# Altium project 2409_MesureTH_RefrigerateurCongelateur_V1.PrjPcb
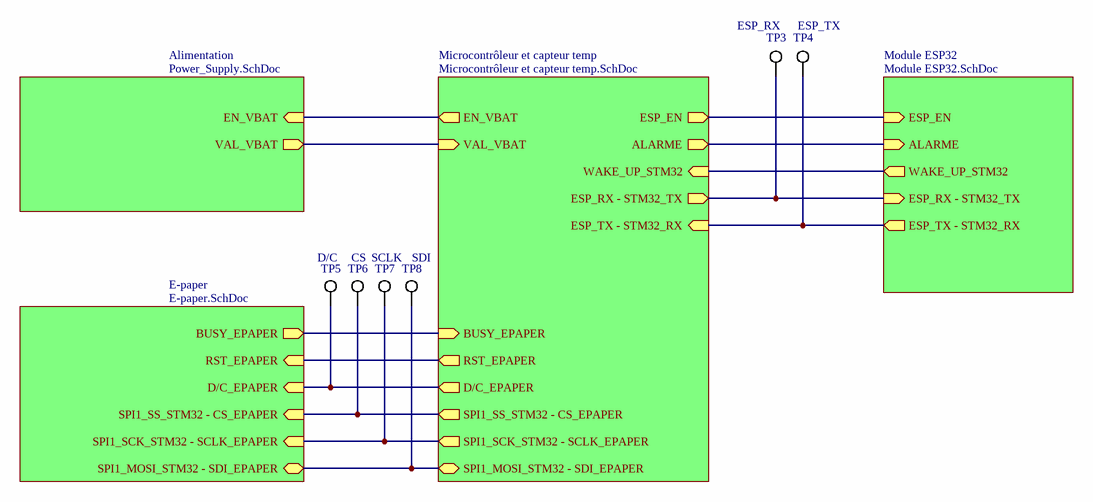
[diagram p0: Schéma bloc.SchDoc]
5 sheets, 80 parts. Net scope: hierarchical (ports join the sheet entries above them; power ports are global).
Board file: 2409_MesureTH_RefrigerateurCongelateur_6C_2L.PcbDoc
Sheets:
  Schéma bloc.SchDoc
    Alimentation = Power_Supply.SchDoc
    Microcontrôleur et capteur temp = Microcontrôleur et capteur temp.SchDoc
    E-paper = E-paper.SchDoc
    Module ESP32 = Module ESP32.SchDoc

## Sheet Schéma bloc.SchDoc: MesureTH
size 276 x 198 mm; Date: 21.08.2024; CheckedBy: CFO; DrawnBy: MPT; Organization: ETML-ES; Address1: Av. Recordon 1bis; Address2: 1004 Lausanne; Address3: Suisse; DocumentNumber: 2409; SheetNumber: 1; SheetTotal: 5; CheckingDate: 26.08.2024

### Parts
TP3  Test_Point_SMD  [5019]  (value not drawn)
TP4  Test_Point_SMD  [5019]  (value not drawn)
TP5  Test_Point_SMD  [5019]  (value not drawn)
TP6  Test_Point_SMD  [5019]  (value not drawn)
TP7  Test_Point_SMD  [5019]  (value not drawn)
TP8  Test_Point_SMD  [5019]  (value not drawn)

### Sub-sheets
Alimentation = Power_Supply.SchDoc: EN_VBAT (in), VAL_VBAT (out)
E-paper = E-paper.SchDoc: BUSY_EPAPER (out), SPI1_MOSI_STM32 - SDI_EPAPER (bidir), RST_EPAPER (in), D/C_EPAPER (in), SPI1_SS_STM32 - CS_EPAPER (in), SPI1_SCK_STM32 - SCLK_EPAPER (in)
Microcontrôleur et capteur temp = Microcontrôleur et capteur temp.SchDoc: EN_VBAT (out), VAL_VBAT (in), BUSY_EPAPER (in), RST_EPAPER (out), D/C_EPAPER (out), SPI1_SS_STM32 - CS_EPAPER (out), SPI1_SCK_STM32 - SCLK_EPAPER (out), SPI1_MOSI_STM32 - SDI_EPAPER (bidir), ESP_EN (out), ALARME (out), WAKE_UP_STM32 (in), ESP_RX - STM32_TX (out), ESP_TX - STM32_RX (in)
Module ESP32 = Module ESP32.SchDoc: ESP_EN (in), ALARME (in), WAKE_UP_STM32 (out), ESP_RX - STM32_TX (in), ESP_TX - STM32_RX (out)

### Nets
IO4: sheet Microcontrôleur et capteur temp/ALARME, sheet Module ESP32/ALARME
IO5: sheet Microcontrôleur et capteur temp/WAKE_UP_STM32, sheet Module ESP32/WAKE_UP_STM32
NetC5_1: sheet Alimentation/VAL_VBAT, sheet Microcontrôleur et capteur temp/VAL_VBAT
NetC16_1: sheet Microcontrôleur et capteur temp/ESP_EN, sheet Module ESP32/ESP_EN
NetJ6_9: sheet Microcontrôleur et capteur temp/BUSY_EPAPER, sheet E-paper/BUSY_EPAPER
NetJ6_10: sheet Microcontrôleur et capteur temp/RST_EPAPER, sheet E-paper/RST_EPAPER
NetJ6_11: TP5.1 ; sheet Microcontrôleur et capteur temp/D/C_EPAPER, sheet E-paper/D/C_EPAPER
NetJ6_12: TP6.1 ; sheet Microcontrôleur et capteur temp/SPI1_SS_STM32 - CS_EPAPER, sheet E-paper/SPI1_SS_STM32 - CS_EPAPER
NetJ6_13: TP7.1 ; sheet Microcontrôleur et capteur temp/SPI1_SCK_STM32 - SCLK_EPAPER, sheet E-paper/SPI1_SCK_STM32 - SCLK_EPAPER
NetJ6_14: TP8.1 ; sheet Microcontrôleur et capteur temp/SPI1_MOSI_STM32 - SDI_EPAPER, sheet E-paper/SPI1_MOSI_STM32 - SDI_EPAPER
NetQ2_1: sheet Alimentation/EN_VBAT, sheet Microcontrôleur et capteur temp/EN_VBAT
NetTP3_1: TP3.1 ; sheet Microcontrôleur et capteur temp/ESP_RX - STM32_TX, sheet Module ESP32/ESP_RX - STM32_TX
NetTP4_1: TP4.1 ; sheet Microcontrôleur et capteur temp/ESP_TX - STM32_RX, sheet Module ESP32/ESP_TX - STM32_RX

### Notes on the sheet
- ESP_RX
- ESP_TX
- D/C
- CS
- SCLK
- SDI
- a
- Dessiné
- A4
- Echelle :
- Mod.
- b
- c
- d
- Contrôlé
- Remplace
- Nb. feuilles
- Feuille n°
- Nom du projet
- No

## Sheet Power_Supply.SchDoc: MesureTH
size 276 x 198 mm; Date: 21.08.2024; CheckedBy: CFO; DrawnBy: MPT; Organization: ETML-ES; Address1: Av. Recordon 1bis; Address2: 1004 Lausanne; Address3: Suisse; DocumentNumber: 2409; SheetNumber: 2; SheetTotal: 5; CheckingDate: 26.08.2024
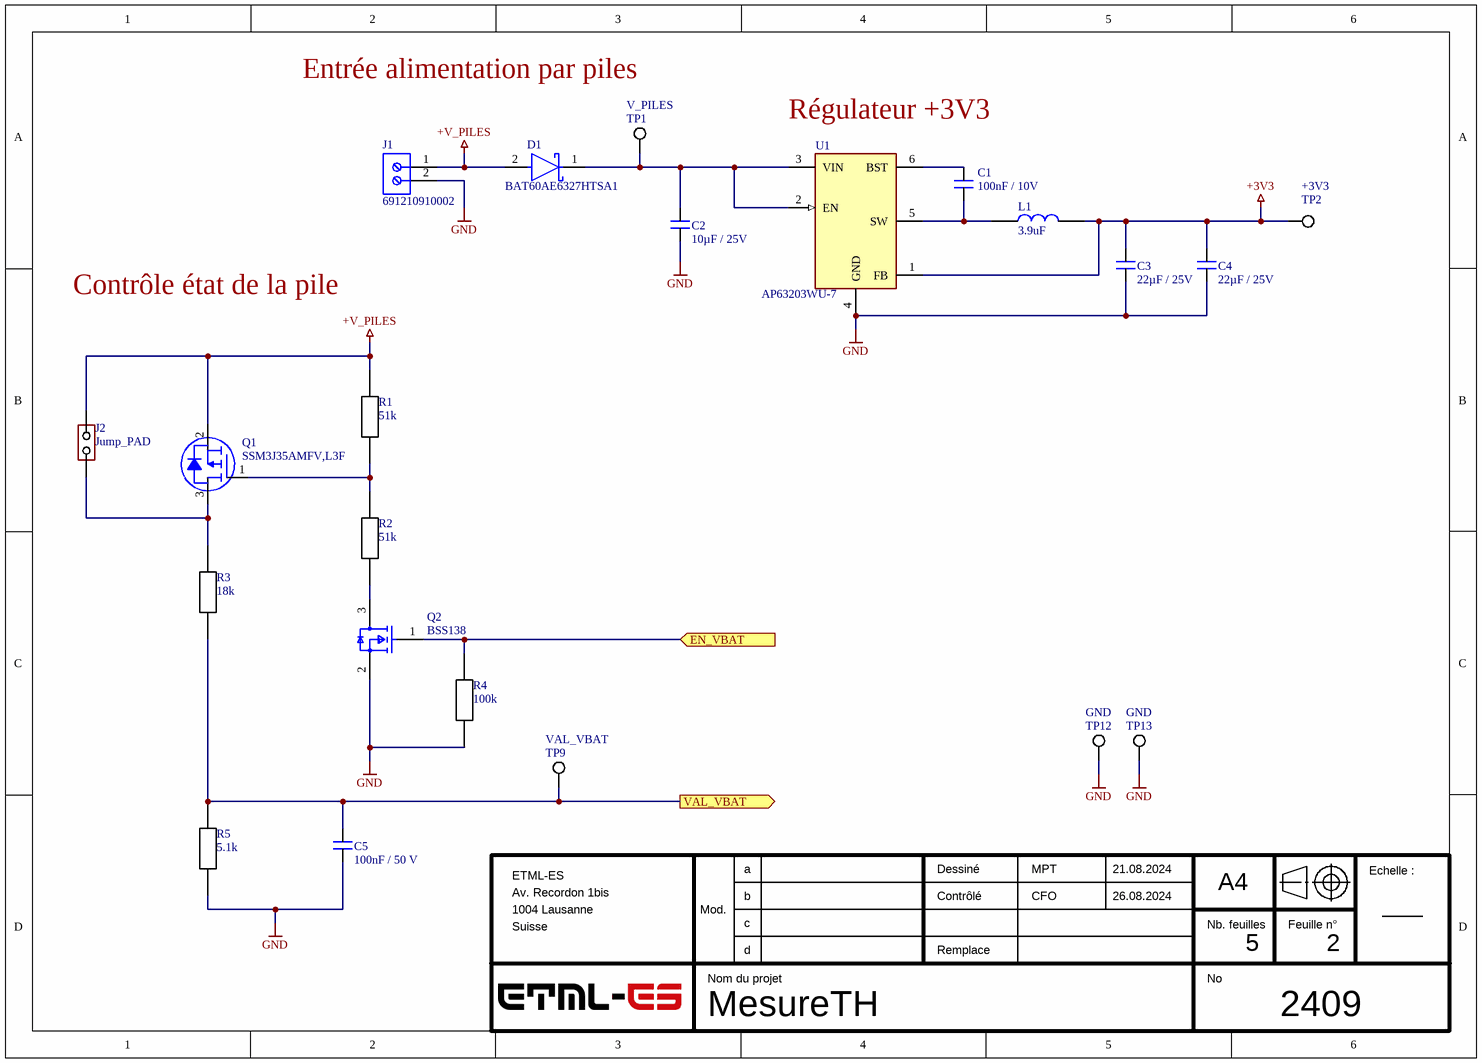
[diagram p1: Power_Supply.SchDoc]

### Parts
C1  100nF / 10V  [WCAP-CSGP_0805_L2W1.25H0.8_Wave]
C2  10µF / 25V  [WCAP-CSGP_0805_L2W1.25H0.8_Wave]
C3  22µF / 25V  [WCAP-CSGP_0805_L2W1.25H0.8_Wave]
C4  22µF / 25V  [WCAP-CSGP_0805_L2W1.25H0.8_Wave]
C5  100nF / 50 V  [WCAP-CSGP_0805_L2W1.25H0.8_Wave]
D1  BAT60AE6327HTSA1  [FP-PG-SOD323-2-IPC_C]
J1  691210910002  [691210910002]
J2  Jump_PAD  [Jump_PAD]
L1  3.9uF  [Inductance 3.9uF]
Q1  SSM3J35AMFV,L3F  [SSM3J35AMFV]
Q2  BSS138  [FP-318-08-IPC_B]
R1  51k  [WRIS-PSMB_0805_L2W1.25H0.35]
R2  51k  [WRIS-PSMB_0805_L2W1.25H0.35]
R3  18k  [WRIS-PSMB_0805_L2W1.25H0.35]
R4  100k  [WRIS-PSMB_0805_L2W1.25H0.35]
R5  5.1k  [WRIS-PSMB_0805_L2W1.25H0.35]
TP1  Test_Point_SMD  [5019]  (value not drawn)
TP2  Test_Point_SMD  [5019]  (value not drawn)
TP9  Test_Point_SMD  [5019]  (value not drawn)
TP12  Test_Point_SMD  [5019]  (value not drawn)
TP13  Test_Point_SMD  [5019]  (value not drawn)
U1  AP63203WU-7  [FP-TSOT26-MFG - duplicate]

### Ports
EN_VBAT (in), VAL_VBAT (out)

### Nets
+3V3: C3.1(+) C4.1(+) L1.2 TP2.1 U1.1(FB)
+V_PILES: D1.2(A) J1.1 J2.2 Q1.2(S) R1.2
GND: C2.2(-) C3.2(-) C4.2(-) C5.2(-) J1.2 Q2.2(S) R4.1 R5.1 TP12.1 TP13.1 U1.4(GND)
NetC1_1: C1.1(+) U1.6(BST)
NetC1_2: C1.2(-) L1.1 U1.5(SW)
NetC2_1: C2.1(+) D1.1(C) TP1.1 U1.2(EN) U1.3(VIN)
NetC5_1: C5.1(+) R3.1 R5.2 TP9.1 ; port VAL_VBAT
NetJ2_1: J2.1 Q1.3(D) R3.2
NetQ1_1: Q1.1(G) R1.1 R2.2
NetQ2_1: Q2.1(G) R4.2 ; port EN_VBAT
NetQ2_3: Q2.3(D) R2.1

### Notes on the sheet
- Entrée alimentation par piles
- (near TP1) V_PILES
- Régulateur +3V3
- (near TP2) +3V3
- Contrôle état de la pile
- (near TP9) VAL_VBAT
- (near TP12) GND
- GND
- a
- Dessiné
- A4
- Echelle :
- Mod.
- b
- c
- d
- Contrôlé
- Remplace
- Nb. feuilles
- Feuille n°
- Nom du projet
- No

### Library data of the parts
C1-C5 = CAPA: Tension: *
D1 = CMP-32890-000004-1: DIODE SCHOTTKY 10V 3A SOD323-2; Forward Voltage: 370mV; Polarity: Standard; Peak Non-Repetitive Surge Current: 5A; Element Configuration: Single; Max Operating Temperature: 85°C; Current Rating: 3A; Number of Pins: 2; Mount: Surface Mount; Forward Current: 3A; Max Reverse Voltage (DC): 10V; Output Current: 3A; Contact Plating: Tin; Average Rectified Current: 3A; Lead Free: Lead Free; Max Repetitive Reverse Voltage (Vrrm): 10V; Voltage Rating (DC): 10V; Radiation Hardening: No; Halogen Free: Not Halogen Free; Case/Package: SOD-323-2; REACH SVHC: No SVHC; Min Operating Temperature: -55°C; Packaging: Tape and Reel
J1 = CMP-1502-02456-2: NexarPartId: 105950649; Current Rating: 6A; Voltage Rating: 150V; Number of Contacts: 2; Number of Rows: 1; Contact Material: Tin; Height: 8.7mm; Max Operating Temperature: 105°C; Min Operating Temperature: -40°C
J2 = Jump_PAD: jump pad smd
L1 = Inductance 3.9uF: FIXED IND 3.9UH 850MA 200 MOHM; MF: EPCOS; MP: B82432T1392K000; SnapEDA_Link: https://www.snapeda.com/parts/B82432T1392K000/EPCOS/view-part/?ref=snap; Package: 1812 EPCOS (TDK); Value: *; Check_prices: https://www.snapeda.com/parts/B82432T1392K000/EPCOS/view-part/?ref=eda; Supplier 1: Digi-Key
Q1 = SSM3J35AMFV,L3F: Canal P 20 V 250mA (Ta) 150mW (Ta) Montage en surface VESM
Q2 = CMP-07173-000101-1: MOSFET N-CH 50V 220MA SOT-23; Turn-Off Delay Time: 20ns; Element Configuration: Single; Rds On Max: 3.5R; Gate to Source Voltage (Vgs): 20V; Threshold Voltage: 1.3V; Number of Elements: 1; Power Dissipation: 360mW; Rise Time: 9ns; Turn-On Delay Time: 2.5ns; Input Capacitance: 27pF; On-State Resistance: 6R; Lead Free: Lead Free; Length: 2.92mm; Width: 1.3mm; Drain to Source Breakdown Voltage: 50V; Min Operating Temperature: -55°C; REACH SVHC: No SVHC; Packaging: Tape and Reel; Radiation Hardening: No; Height: 0.93mm; Drain to Source Voltage (Vdss): 50V; Current Rating: 220mA; Voltage Rating (DC): 50V; Weight: 0.03g; Continuous Drain Current (ID): 220mA; Number of Pins: 3; Nominal Vgs: 1.3V; Max Power Dissipation: 360mW; Fall Time: 9ns; Drain to Source Resistance: 3.5R; Contact Plating: Tin; Case/Package: SOT-23; Package Quantity: 1; Dual Supply Voltage: 50V; Mount: Surface Mount; Termination: SMD/SMT; Max Operating Temperature: 150°C
R1-R5 = Resistance
U1 = Regulateur 3.3V: IC REG BUCK 3.3V 2A TSOT26; Manufacturer: Diodes Inc.; Output Type: Fixed; Min Supply Voltage: 3.8V; Number Of Outputs: 1; Max Junction Temp: +160°C; Nominal Supply Current: 22uA; Standoff Height: 0.01mm; Switching Frequency: 1.1MHz; Max Supply Voltage: 32V; ComponentLink2Description: Datasheet; Device Class L1: Integrated Circuits (ICs); Temperature: to +160°C; Device Class L3: Voltage Regulators - Switching; RoHS: TRUE; Octopart: https://octopart.com/ap63203wu-7-diodes+inc.-98099550; Output Voltage: 3.3V; Lead Free: Yes; ComponentLink2URL: https://www.diodes.com/assets/Datasheets/AP63200-AP63201-AP63203-AP63205.pdf; Digikey Description: IC REG BUCK 3.3V 2A TSOT26; Footprint Url: https://www.diodes.com/assets/Package-Files/TSOT26.pdf; Ambient Temperature Range High: +85°C; Height: 1mm; Automotive: No; Temperature Range High: +160°C; Switching Topology: Buck; Output Current: 2A; Package: TSOT26; Category: IC; Mouser Description: AP63203 Series 3.3 V 2 A SMT Fixed Low IQ Synchronous Buck - TSOT-26; Device Class L2: Power Management ICs; Ambient Temperature Range Low: -40°C; Manufacturer Part Number: AP63203WU-7

## Sheet Microcontrôleur et capteur temp.SchDoc: MesureTH
size 276 x 198 mm; Date: 21.08.2024; CheckedBy: CFO; DrawnBy: MPT; Organization: ETML-ES; Address1: Av. Recordon 1bis; Address2: 1004 Lausanne; Address3: Suisse; DocumentNumber: 2409; SheetNumber: 3; SheetTotal: 5; CheckingDate: 26.08.2024
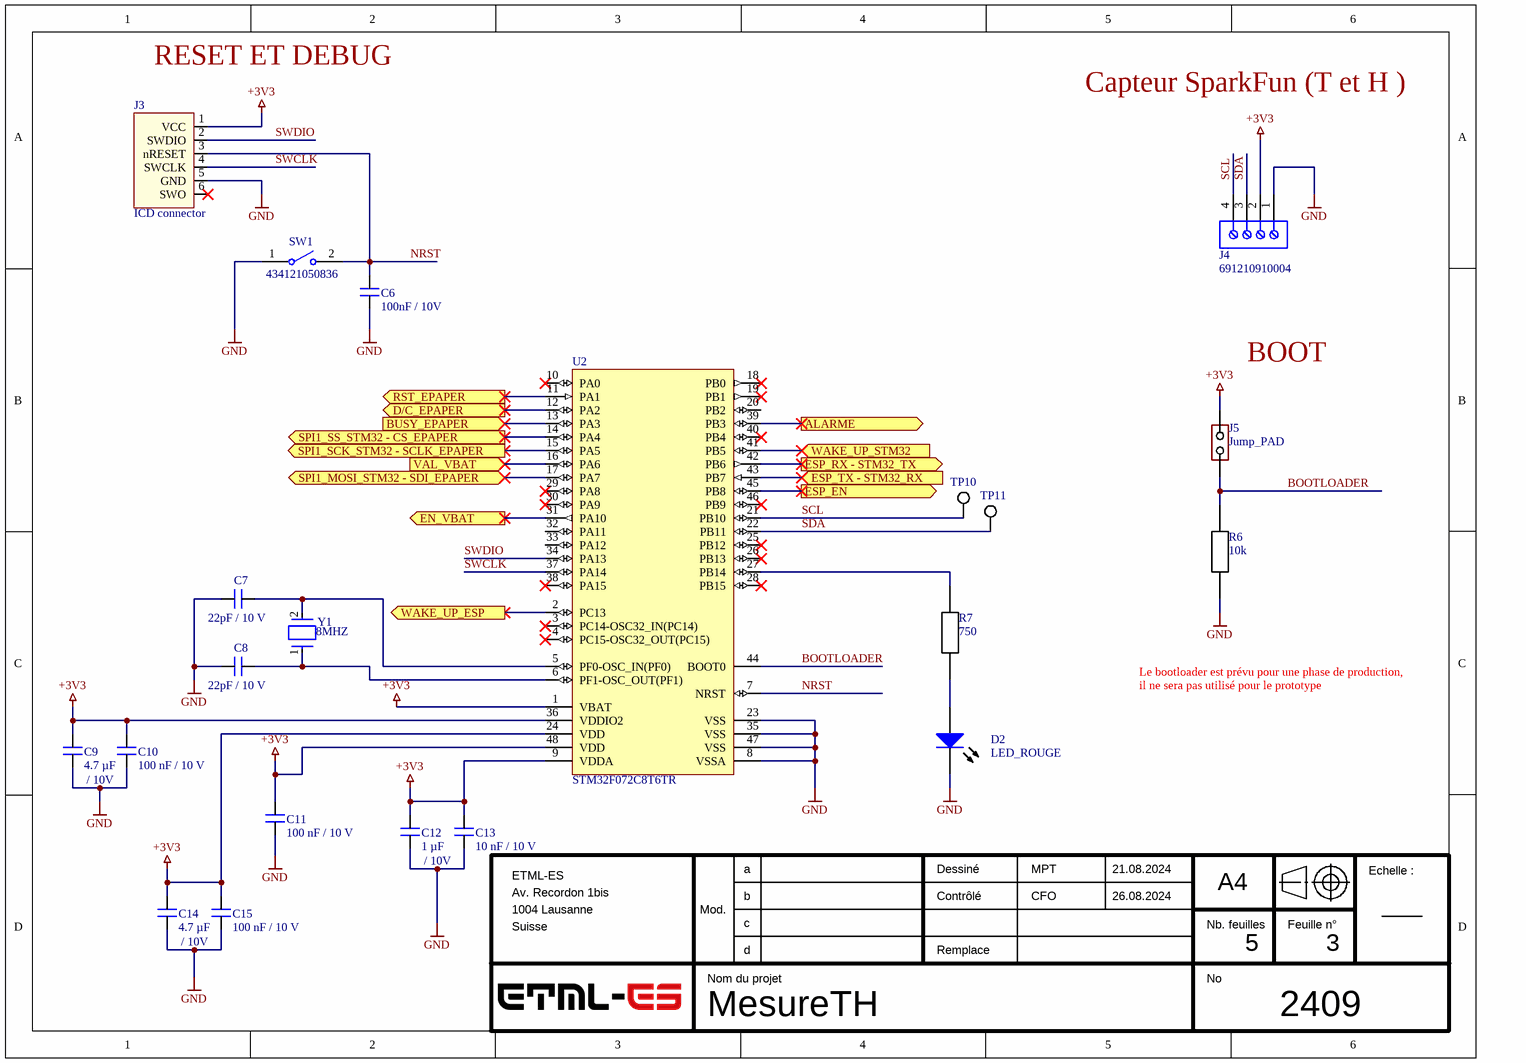
[diagram p2: Microcontrôleur et capteur temp.SchDoc]

### Parts
C6  100nF / 10V  [WCAP-CSGP_0805_L2W1.25H0.8_Wave]
C7  22pF / 10 V  [WCAP-CSGP_0805_L2W1.25H0.8_Wave]
C8  22pF / 10 V  [WCAP-CSGP_0805_L2W1.25H0.8_Wave]
C9  4.7 µF  [WCAP-CSGP_0805_L2W1.25H0.8_Wave]
C10  100 nF / 10 V  [WCAP-CSGP_0805_L2W1.25H0.8_Wave]
C11  100 nF / 10 V  [WCAP-CSGP_0805_L2W1.25H0.8_Wave]
C12  1 µF  [WCAP-CSGP_0805_L2W1.25H0.8_Wave]
C13  10 nF / 10 V  [WCAP-CSGP_0805_L2W1.25H0.8_Wave]
C14  4.7 µF  [WCAP-CSGP_0805_L2W1.25H0.8_Wave]
C15  100 nF / 10 V  [WCAP-CSGP_0805_L2W1.25H0.8_Wave]
D2  LED_ROUGE  [LED_SMD_B_AND_R]
J3  ICD connector  [TC2030-MCP]  (no BOM)
J4  691210910004  [691210910004]
J5  Jump_PAD  [Jump_PAD]
R6  10k  [WRIS-PSMB_0805_L2W1.25H0.35]
R7  750  [WRIS-PSMB_0805_L2W1.25H0.35]
SW1  434121050836  [WS-TASV_L6W3.5H5_4341x10508x6]
TP10  Test_Point_SMD  [5019]  (value not drawn)
TP11  Test_Point_SMD  [5019]  (value not drawn)
U2  STM32F072C8T6TR  [LQFP48-7x7mm]
Y1  8MHZ  [FP-ABLS-MFG]

### Ports
ALARME (out), BUSY_EPAPER (in), D/C_EPAPER (out), EN_VBAT (out), ESP_EN (out), ESP_RX - STM32_TX (out), ESP_TX - STM32_RX (in), RST_EPAPER (out), SPI1_MOSI_STM32 - SDI_EPAPER (bidir), SPI1_SCK_STM32 - SCLK_EPAPER (out), SPI1_SS_STM32 - CS_EPAPER (out), VAL_VBAT (in), WAKE_UP_ESP (out), WAKE_UP_STM32 (in)

### Nets
+3V3: C9.1(+) C10.1(+) C11.1(+) C12.1(+) C13.1(+) C14.1(+) C15.1(+) J3.1(VCC) J4.2 J5.2 U2.1(VBAT) U2.9(VDDA) U2.24(VDD) U2.36(VDDIO2) U2.48(VDD)
GND: C6.2(-) C7.1(+) C8.1(+) C9.2(-) C10.2(-) C11.2(-) C12.2(-) C13.2(-) C14.2(-) C15.2(-) D2.1(K) J3.5(GND) J4.1 R6.1 SW1.1 U2.8(VSSA) U2.23(VSS) U2.35(VSS) U2.47(VSS)
BOOTLOADER: J5.1 R6.2 U2.44(BOOT0)
IO4: U2.39(PB3) ; port ALARME
IO5: U2.41(PB5) ; port WAKE_UP_STM32
NRST: C6.1(+) J3.3(nRESET) SW1.2 U2.7(NRST)
SCL: J4.4 TP10.1 U2.21(PB10)
SDA: J4.3 TP11.1 U2.22(PB11)
SWCLK: J3.4(SWCLK) U2.37(PA14)
SWDIO: J3.2(SWDIO) U2.34(PA13)
NetC5_1: U2.16(PA6) ; port VAL_VBAT
NetC7_2: C7.2(-) U2.5(PF0-OSC_IN(PF0)) Y1.2
NetC8_2: C8.2(-) U2.6(PF1-OSC_OUT(PF1)) Y1.1
NetC16_1: U2.45(PB8) ; port ESP_EN
NetD2_2: D2.2(A) R7.1
NetJ6_9: U2.13(PA3) ; port BUSY_EPAPER
NetJ6_10: U2.11(PA1) ; port RST_EPAPER
NetJ6_11: U2.12(PA2) ; port D/C_EPAPER
NetJ6_12: U2.14(PA4) ; port SPI1_SS_STM32 - CS_EPAPER
NetJ6_13: U2.15(PA5) ; port SPI1_SCK_STM32 - SCLK_EPAPER
NetJ6_14: U2.17(PA7) ; port SPI1_MOSI_STM32 - SDI_EPAPER
NetQ2_1: U2.31(PA10) ; port EN_VBAT
NetR7_2: R7.2 U2.27(PB14)
NetTP3_1: U2.42(PB6) ; port ESP_RX - STM32_TX
NetTP4_1: U2.43(PB7) ; port ESP_TX - STM32_RX
NetU2_2: U2.2(PC13) ; port WAKE_UP_ESP

Not connected (* = marked no-connect by the designer): J3 6(SWO)*; U2 3(PC14-OSC32_IN(PC14))* 4(PC15-OSC32_OUT(PC15))* 10(PA0)* 18(PB0)* 19(PB1)* 20(PB2) 25(PB12)* 26(PB13)* 28(PB15)* 29(PA8)* 30(PA9)* 32(PA11) 33(PA12) 38(PA15)* 40(PB4)* 46(PB9)*

### Notes on the sheet
- RESET ET DEBUG
- Capteur SparkFun (T et H )
- BOOT
- Le bootloader est prévu pour une phase de production,
- il ne sera pas utilisé pour le prototype
- / 10V
- a
- Dessiné
- A4
- Echelle :
- Mod.
- b
- c
- d
- Contrôlé
- Remplace
- Nb. feuilles
- Feuille n°
- Nom du projet
- No

### Library data of the parts
C6-C15 = CAPA: Tension: *
D2 = LED
J3 = TC2030-MCP-NL: Conector par STlinj
J4 = CMP-1502-02458-2: NexarPartId: 105950651
J5 = Jump_PAD: jump pad smd
R6 R7 = Resistance
SW1 = CMP-1459-00008-2: NexarPartId: 57114500; Throw Configuration: SPST; Switch Travel: 250µm; Switch Function: Off-Mom; Current Rating: 50mA; Illumination Type: Non-Illuminated; Mechanical Life: 50kcycles; Voltage Rating: 12V; Insulation Resistance: 100MΩ; Actuator Material: Liquid Crystal Polymer, Polymer; Packaging: Tape and Reel; Min Operating Temperature: -40°C; Height: 5mm; Termination: SMD/SMT; Max Operating Temperature: 85°C; RoHS: Compliant; Contact Plating: Silver
U2 = STM32F072C8T6TR: ARM Cortex-M0 32-bit MCU, 64 KB Flash, 16 KB Internal RAM, 37 I/Os, 48-Pin LQFP, -40 to 85 degC, Tray; Manufacturer: STMicroelectronics; Operating Frequency(F) (Processor speed) (MHz): 48; FLASH Size (Prog) (kB): 64; I/Os (High Current): 37; D/A Converter: 1; Internal RAM Size (kB): 16; Supply Voltage(Vcc) min (V): 2; Package Reference: LQFP48; DatasheetVersion: Rev. 5; Core: ARM Cortex-M0; ComponentLink1Description: Manufacturer URL; ComponentLink1URL: http://www.st.com/; Packing: Tray; Mounting Technology: Surface Mount; Package Description: 48-Pin Low Profile Quad Flat Package, Body 7 x 7 mm, Pitch 0.5 mm; ComponentLink2URL: http://www.st.com/st-web-ui/static/active/en/resource/technical/document/datasheet/DM00090510.pdf; ComponentLink2Description: Datasheet; PartNumber: STM32F072C8T6
Y1 = CMP-27762-009874-1: CRYSTAL 8.0000MHZ 18PF SMD; ESR (Equivalent Series Resistance): 80R; Frequency Stability: 50ppm; Tolerance: 20ppm; Min Operating Temperature: -20°C; Lead Free: Lead Free; Operating Frequency: 8 MHz; Width: 4.7mm; Packaging: Tape and Reel; Series: ABLS; Accuracy: 20ppm; Length: 11.4mm; Frequency Tolerance: 20ppm; Termination: SMD/SMT; Number of Pins: 2; Radiation Hardening: No; Depth: 4.7mm; REACH SVHC: No SVHC; Contact Plating: Tin; Load Capacitance: 18pF; Case/Package: SMD/SMT; Mount: Surface Mount; Package Quantity: 1000; Max Operating Temperature: 70°C; Height: 0.165inch; Frequency: 8MHz; Series Resistance: 80R

## Sheet E-paper.SchDoc: MesureTH
size 276 x 198 mm; Date: 21.08.2024; CheckedBy: CFO; DrawnBy: MPT; Organization: ETML-ES; Address1: Av. Recordon 1bis; Address2: 1004 Lausanne; Address3: Suisse; DocumentNumber: 2409; SheetNumber: 5; SheetTotal: 5; CheckingDate: 26.08.2024
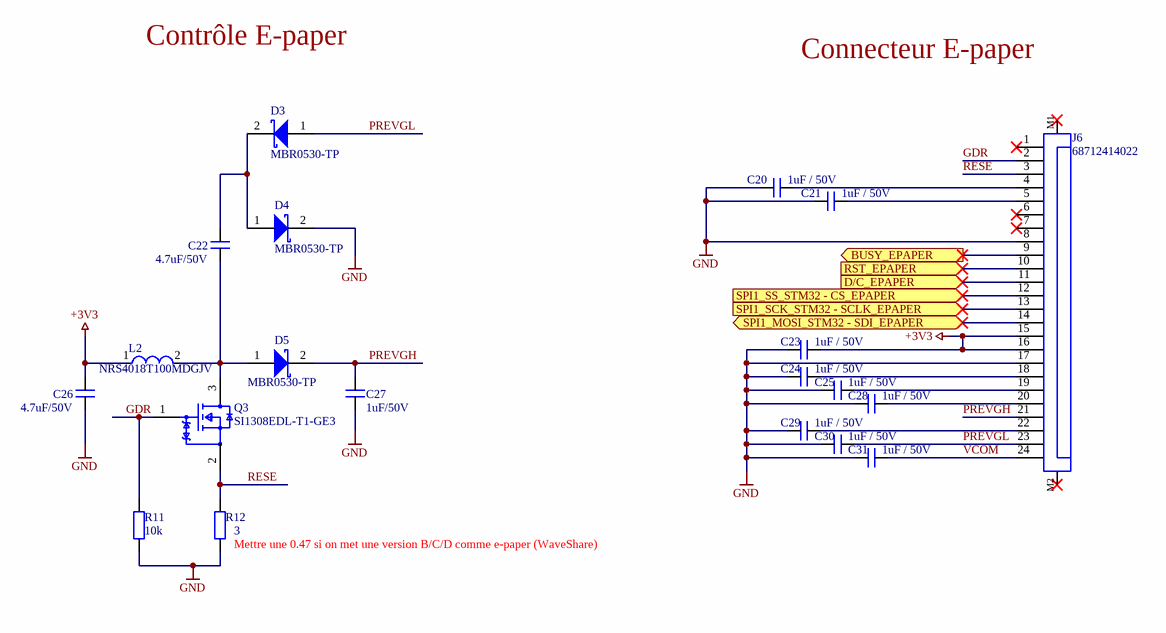
[diagram p3: E-paper.SchDoc]

### Parts
C20  1uF / 50V  [WCAP-CSGP_0805_L2W1.25H0.8_Wave]
C21  1uF / 50V  [WCAP-CSGP_0805_L2W1.25H0.8_Wave]
C22  4.7uF/50V  [WCAP-CSGP_0805_L2W1.25H0.8_Wave]
C23  1uF / 50V  [WCAP-CSGP_0805_L2W1.25H0.8_Wave]
C24  1uF / 50V  [WCAP-CSGP_0805_L2W1.25H0.8_Wave]
C25  1uF / 50V  [WCAP-CSGP_0805_L2W1.25H0.8_Wave]
C26  4.7uF/50V  [WCAP-CSGP_0805_L2W1.25H0.8_Wave]
C27  1uF/50V  [WCAP-CSGP_0805_L2W1.25H0.8_Wave]
C28  1uF / 50V  [WCAP-CSGP_0805_L2W1.25H0.8_Wave]
C29  1uF / 50V  [WCAP-CSGP_0805_L2W1.25H0.8_Wave]
C30  1uF / 50V  [WCAP-CSGP_0805_L2W1.25H0.8_Wave]
C31  1uF / 50V  [WCAP-CSGP_0805_L2W1.25H0.8_Wave]
D3  MBR0530-TP  [ONSC-SOD-123-2-425-04_V]
D4  MBR0530-TP  [ONSC-SOD-123-2-425-04_V]
D5  MBR0530-TP  [ONSC-SOD-123-2-425-04_V]
J6  68712414022  [68712414022]
L2  NRS4018T100MDGJV  [FP-NR4018-MFG]
Q3  SI1308EDL-T1-GE3  [FP-5549-MFG]
R11  10k  [WRIS-PSMB_0805_L2W1.25H0.35]
R12  3  [WRIS-PSMB_0805_L2W1.25H0.35]

### Ports
BUSY_EPAPER (out), D/C_EPAPER (in), RST_EPAPER (in), SPI1_MOSI_STM32 - SDI_EPAPER (bidir), SPI1_SCK_STM32 - SCLK_EPAPER (in), SPI1_SS_STM32 - CS_EPAPER (in)

### Nets
+3V3: C23.2(-) C26.1(+) J6.15 J6.16 L2.1
GND: C20.1(+) C21.1(+) C23.1(+) C24.1(+) C25.1(+) C26.2(-) C27.2(-) C28.1(+) C29.1(+) C30.1(+) C31.1(+) D4.2(C) J6.8 J6.17 R11.1 R12.1
GDR: J6.2 Q3.1(G) R11.2
PREVGH: C27.1(+) D5.2(C) J6.21
PREVGL: C30.2(-) D3.1(A) J6.23
RESE: J6.3 Q3.2(S) R12.2
VCOM: C31.2(-) J6.24
NetC20_2: C20.2(-) J6.4
NetC21_2: C21.2(-) J6.5
NetC22_1: C22.1(+) D3.2(C) D4.1(A)
NetC22_2: C22.2(-) D5.1(A) L2.2 Q3.3(D)
NetC24_2: C24.2(-) J6.18
NetC25_2: C25.2(-) J6.19
NetC28_2: C28.2(-) J6.20
NetC29_2: C29.2(-) J6.22
NetJ6_9: J6.9 ; port BUSY_EPAPER
NetJ6_10: J6.10 ; port RST_EPAPER
NetJ6_11: J6.11 ; port D/C_EPAPER
NetJ6_12: J6.12 ; port SPI1_SS_STM32 - CS_EPAPER
NetJ6_13: J6.13 ; port SPI1_SCK_STM32 - SCLK_EPAPER
NetJ6_14: J6.14 ; port SPI1_MOSI_STM32 - SDI_EPAPER

Not connected (* = marked no-connect by the designer): J6 1* 6* 7* M1* M2*

### Notes on the sheet
- Contrôle E-paper
- Connecteur E-paper
- (near R12) Mettre une 0.47 si on met une version B/C/D comme e-paper (WaveShare)
- a
- Dessiné
- A4
- Echelle :
- Mod.
- b
- c
- d
- Contrôlé
- Remplace
- Nb. feuilles
- Feuille n°
- Nom du projet
- No

### Library data of the parts
C20-C31 = CAPA: Tension: *
J6 = CMP-1502-01558-2: NexarPartId: 22802323; Pitch: 500µm; Current Rating: 500mA; Number of Positions: 24; Contact Resistance: 20mΩ; Actuator Material: Liquid Crystal Polymer, Polymer; Insulation Resistance: 100MΩ; Contact Location: Top; Gender: Receptacle; Operating Supply Voltage: 50V; Mount: Surface Mount; Max Operating Temperature: 85°C; Number of Rows: 1; Housing Material: Liquid Crystal Polymer; Contact Material: Bronze, Tin; Termination: Solder; Flammability Rating: UL94 V-0; Number of Contacts: 24; Packaging: Tape and Reel; RoHS: Compliant; Min Operating Temperature: -25°C; Orientation: Horizontal; Contact Plating: Tin; Lead Pitch: 500µm; Width: 2.1mm; Length: 12.6mm; REACH SVHC: Unknown; Voltage Rating: 50V; Number of Pins: 24
L2 = CMP-14484-000008-2: SMD Power Inductors for Automotive Applications 10uH ±20% 1.2A 0.18Ω; Core Material: Ferrite; Shielding: Shielded; Test Frequency: 100kHz; Saturation Current: 1.3A; Self Resonant Frequency: 25MHz; DC Resistance (DCR): 180mR; Inductance: 10uH; RoHS Compliant: Yes; Resistor Type: Wirewound; Depth: 4mm; Mount: Surface Mount; Termination: SMD/SMT; Packaging: Tape and Reel; Length: 4mm; Max DC Current: 1.2A; Max Operating Temperature: 125°C; Min Operating Temperature: -40°C; Halogen Free: Halogen Free; Width: 0.157inch; Package Quantity: 3500; Height - Seated (Max): 0.071inch; Weight: 0.003527oz; Tolerance: 20%; Ratings: AEC-Q200; Radiation Hardening: No; Current Rating: 1.2A; Case/Package: Nonstandard; Height: 1.8mm
Q3 = CMP-02550-000099-2: MOSFET N-CH 30V 1.4A SC-70-3; Fall Time: 8ns; Max Power Dissipation: 500mW; Rise Time: 9ns; Rds On Max: 132mR; Power Dissipation: 400mW; Polarity: N-CHANNEL; Number of Elements: 1; Element Configuration: Single; Threshold Voltage: 600mV; Continuous Drain Current (ID): 1.5A; Gate to Source Voltage (Vgs): 12V; Turn-On Delay Time: 2ns; Input Capacitance: 105pF; Package Quantity: 3000; REACH SVHC: No SVHC; Mount: Surface Mount; Packaging: Tape and Reel; On-State Resistance: 132mR; Drain-source On Resistance-Max: 132mR; Lead Free: Lead Free; Drain to Source Breakdown Voltage: 30V; Series: TrenchFET®; Max Operating Temperature: 150°C; Drain to Source Resistance: 132mR; Radiation Hardening: No; Length: 2.2mm; Min Operating Temperature: -55°C; Number of Channels: 1; Drain to Source Voltage (Vdss): 30V; Number of Pins: 3; Turn-Off Delay Time: 8ns; Weight: 0.004395oz; RoHS Compliant: Yes; Width: 1.35mm; Height: 1mm; Case/Package: SOT-323
R11 R12 = Res2: Resistor; Fournisseur: ETML-ES; Ref Fournisseur: En stock; Published: 8-Jun-2000; LatestRevisionDate: 17-Jul-2002; LatestRevisionNote: Re-released for DXP Platform.; PackageReference: AXIAL-0.4; Publisher: Altium Limited; PackageDescription: Axial Device, Thru-Hole; 2 Leads; 0.4 in Pin Spacing; Prix unitaire: *

## Sheet Module ESP32.SchDoc: MesureTH
size 276 x 198 mm; Date: 21.08.2024; CheckedBy: CFO; DrawnBy: MPT; Organization: ETML-ES; Address1: Av. Recordon 1bis; Address2: 1004 Lausanne; Address3: Suisse; DocumentNumber: 2409; Revision: 2409; SheetNumber: 4; SheetTotal: 5; CheckingDate: 26.08.2024
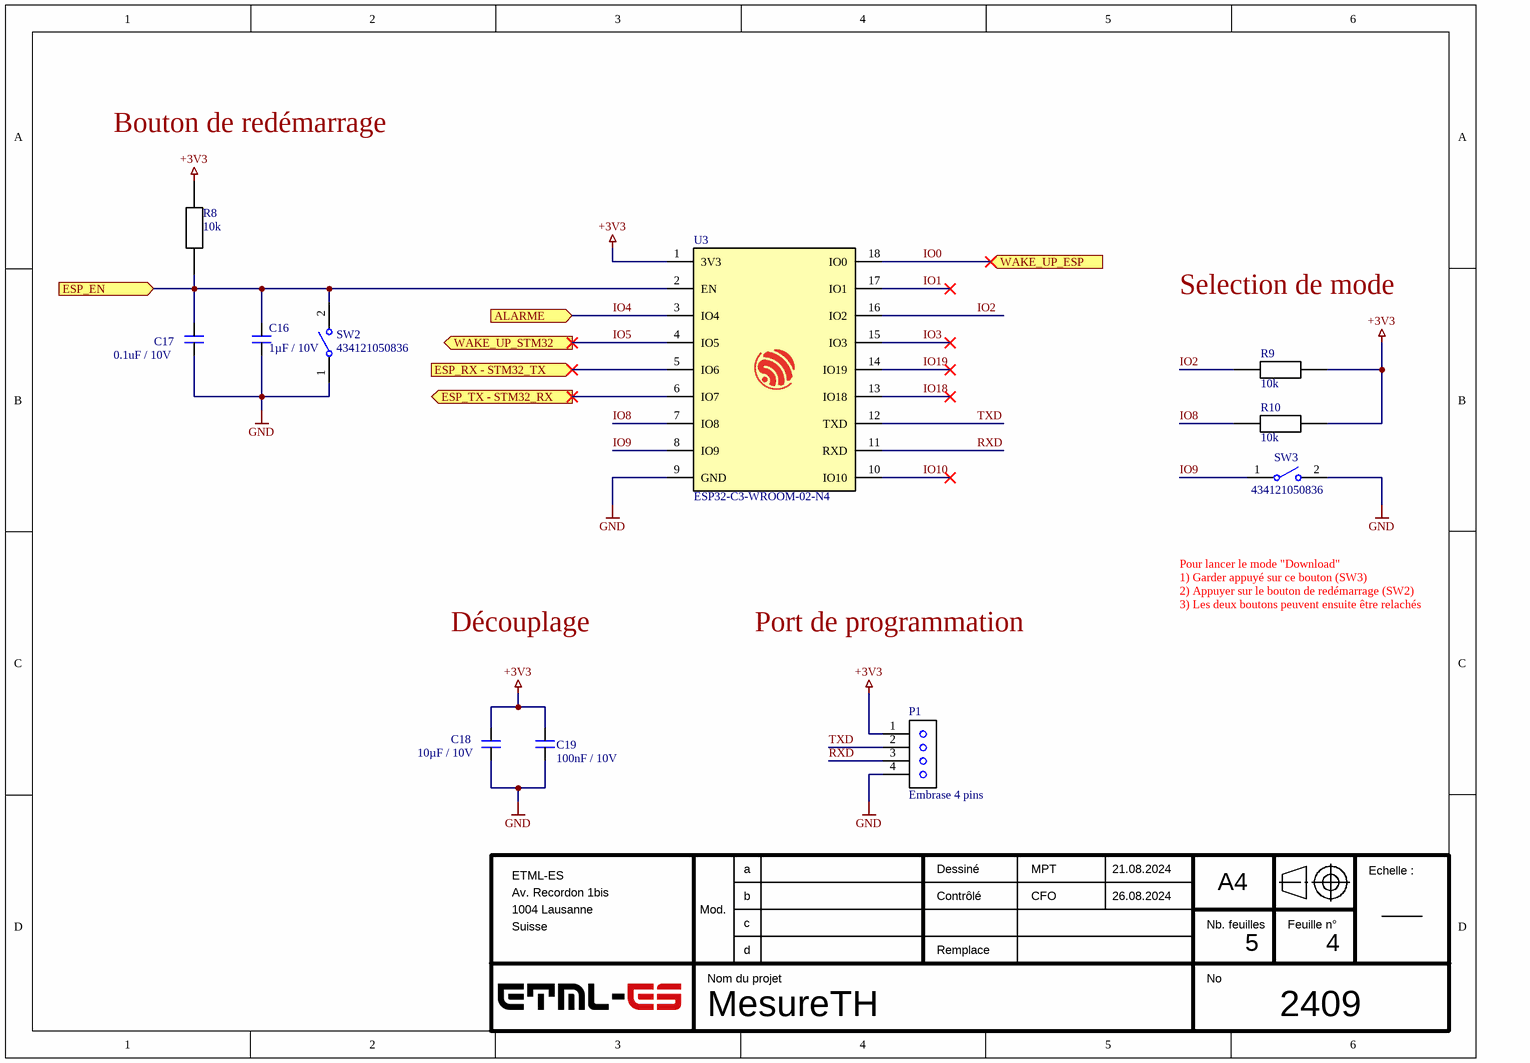
[diagram p4: Module ESP32.SchDoc]

### Parts
C16  1µF / 10V  [WCAP-CSGP_0805_L2W1.25H0.8_Wave]
C17  0.1uF / 10V  [WCAP-CSGP_0805_L2W1.25H0.8_Wave]
C18  10µF / 10V  [WCAP-CSGP_0805_L2W1.25H0.8_Wave]
C19  100nF / 10V  [WCAP-CSGP_0805_L2W1.25H0.8_Wave]
P1  Embrase 4 pins  [1x4]
R8  10k  [WRIS-PSMB_0805_L2W1.25H0.35]
R9  10k  [WRIS-PSMB_0805_L2W1.25H0.35]
R10  10k  [WRIS-PSMB_0805_L2W1.25H0.35]
SW2  434121050836  [WS-TASV_L6W3.5H5_4341x10508x6]
SW3  434121050836  [WS-TASV_L6W3.5H5_4341x10508x6]
U3  ESP32-C3-WROOM-02-N4  [ESP32-C3-WROOM-02-H4]

### Ports
ALARME (in), ESP_EN (in), ESP_RX - STM32_TX (in), ESP_TX - STM32_RX (out), WAKE_UP_ESP (in), WAKE_UP_STM32 (out)

### Nets
+3V3: C18.1(+) C19.1(+) P1.1(VCC) R8.2 R9.2 R10.2 U3.1(3V3)
GND: C16.2(-) C17.2(-) C18.2(-) C19.2(-) P1.4(VCC) SW2.1 SW3.2 U3.9(GND)
IO0: U3.18(IO0) ; port WAKE_UP_ESP
IO1: U3.17(IO1)
IO2: R9.1 U3.16(IO2)
IO3: U3.15(IO3)
IO4: U3.3(IO4) ; port ALARME
IO5: U3.4(IO5) ; port WAKE_UP_STM32
IO8: R10.1 U3.7(IO8)
IO9: SW3.1 U3.8(IO9)
IO10: U3.10(IO10)
IO18: U3.13(IO18)
IO19: U3.14(IO19)
RXD: P1.3(VCC) U3.11(RXD)
TXD: P1.2(VCC) U3.12(TXD)
NetC16_1: C16.1(+) C17.1(+) R8.1 SW2.2 U3.2(EN) ; port ESP_EN
NetTP3_1: U3.5(IO6) ; port ESP_RX - STM32_TX
NetTP4_1: U3.6(IO7) ; port ESP_TX - STM32_RX

### Notes on the sheet
- Bouton de redémarrage
- Selection de mode
- Pour lancer le mode "Download"
- 1) Garder appuyé sur ce bouton (SW3)
- 2) Appuyer sur le bouton de redémarrage (SW2)
- 3) Les deux boutons peuvent ensuite être relachés
- Découplage
- Port de programmation
- a
- Dessiné
- A4
- Echelle :
- Mod.
- b
- c
- d
- Contrôlé
- Remplace
- Nb. feuilles
- Feuille n°
- Nom du projet
- No

### Library data of the parts
C16-C19 = CAPA: Tension: *
R8-R10 = Resistance
SW2 SW3 = CMP-1459-00008-2: as SW1 on sheet Microcontrôleur et capteur temp; Packaging: Tape and Reel; Min Operating Temperature: -40°C; Height: 5mm; Termination: SMD/SMT; Max Operating Temperature: 85°C; RoHS: Compliant; Contact Plating: Silver
U3 = ESP32-C3-WROOM-02-N4: WiFi Modules (802.11) (Engineering Samples) SMD module, ESP32-C3, 4MB SPI flash, PCB antenna, -40 C +85 C; Manufacturer_Name: Espressif Systems; Geometry.Height: 3.35mm; Manufacturer_Part_Number: ESP32-C3-WROOM-02-N4; Mouser Part Number: 356-ESP32C3WROOM02N4; Mouser Price/Stock: https://www.mouser.co.uk/ProductDetail/Espressif-Systems/ESP32-C3-WROOM-02-N4?qs=stqOd1AaK7%2FqjTZKEOgfUg%3D%3D; Arrow Part Number: *; Arrow Price/Stock: *; Datasheet Link: https://www.mouser.ch/datasheet/2/891/Espressif_ESP32_C3_WROOM_02-2006871.pdf

## Nets that join several sheets
+3V3: Power_Supply (5 pins), Microcontrôleur et capteur temp (15 pins), E-paper (5 pins), Module ESP32 (7 pins)
GND: Power_Supply (11 pins), Microcontrôleur et capteur temp (19 pins), E-paper (16 pins), Module ESP32 (8 pins)
IO4: Microcontrôleur et capteur temp (U2.39), Module ESP32 (U3.3)
IO5: Microcontrôleur et capteur temp (U2.41), Module ESP32 (U3.4)
NetC5_1: Power_Supply (C5.1 R3.1 R5.2 TP9.1), Microcontrôleur et capteur temp (U2.16)
NetC16_1: Microcontrôleur et capteur temp (U2.45), Module ESP32 (5 pins)
NetJ6_9: Microcontrôleur et capteur temp (U2.13), E-paper (J6.9)
NetJ6_10: Microcontrôleur et capteur temp (U2.11), E-paper (J6.10)
NetJ6_11: Schéma bloc (TP5.1), Microcontrôleur et capteur temp (U2.12), E-paper (J6.11)
NetJ6_12: Schéma bloc (TP6.1), Microcontrôleur et capteur temp (U2.14), E-paper (J6.12)
NetJ6_13: Schéma bloc (TP7.1), Microcontrôleur et capteur temp (U2.15), E-paper (J6.13)
NetJ6_14: Schéma bloc (TP8.1), Microcontrôleur et capteur temp (U2.17), E-paper (J6.14)
NetQ2_1: Power_Supply (Q2.1 R4.2), Microcontrôleur et capteur temp (U2.31)
NetTP3_1: Schéma bloc (TP3.1), Microcontrôleur et capteur temp (U2.42), Module ESP32 (U3.5)
NetTP4_1: Schéma bloc (TP4.1), Microcontrôleur et capteur temp (U2.43), Module ESP32 (U3.6)